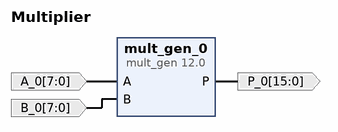
[diagram p0: block diagram of the top level]
# Vivado block design Multiplier, xc7k70tfbv676-1, Vivado 2024.1
create_bd_design Multiplier

create_bd_port -dir I -from 7 -to 0 -type data A_0
create_bd_port -dir I -from 7 -to 0 -type data B_0
create_bd_port -dir O -from 15 -to 0 -type data P_0

create_bd_cell -type ip -vlnv xilinx.com:ip:mult_gen:12.0 mult_gen_0
set_property -dict [list \
  CONFIG.PipeStages 0 \
  CONFIG.PortAType Unsigned \
  CONFIG.PortAWidth 8 \
  CONFIG.PortBType Unsigned \
  CONFIG.PortBWidth 8 \
] [get_bd_cells mult_gen_0]

# ---- connections ----

connect_bd_net -net A_0_1 [get_bd_ports A_0] [get_bd_pins mult_gen_0/A]
connect_bd_net -net B_0_1 [get_bd_ports B_0] [get_bd_pins mult_gen_0/B]
connect_bd_net [get_bd_pins mult_gen_0/P] [get_bd_ports P_0]

validate_bd_design
save_bd_design
